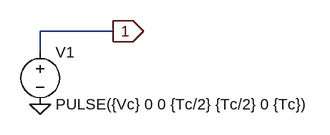
[diagram p0: schematic carriertriangle.asc]
carriertriangle.asc, the LTspice schematic file:
Version 4
SHEET 1 880 680
WIRE 352 128 240 128
WIRE 240 160 240 128
FLAG 240 240 0
FLAG 352 128 1
IOPIN 352 128 Out
SYMBOL voltage 240 144 R0
WINDOW 123 0 0 Left 0
WINDOW 39 0 0 Left 0
SYMATTR InstName V1
SYMATTR Value PULSE({Vc} 0 0 {Tc/2} {Tc/2} 0 {Tc})

The netlist it stands for:
* carriertriangle.asc
V1 1 0 PULSE({Vc} 0 0 {Tc/2} {Tc/2} 0 {Tc})
.backanno
.end